# EAGLE design Li-Ion Batteryy (EAGLE 7.7.0)
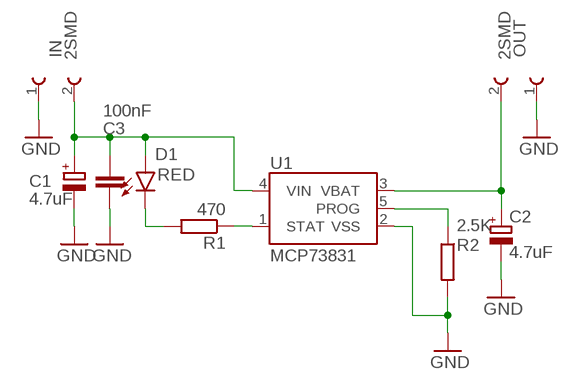
[diagram p0: schematic, sheet 1]

## Parts
C1  4.7uF  CPOL-EUSMCA  [SMC_A]
C2  4.7uF  CPOL-EUSMCA  [SMC_A]
C3  100nF  C-EUC0805  [C0805]
D1  RED  LED-RED1206  [LED-1206]
IN  2SMD  [2SMD]
OUT  2SMD  [2SMD]
R1  470  R-EU_R1206  [R1206]
R2  2.5K  R-EU_R1206  [R1206]
U1  MCP73831  [SOT23-5]

## Nets
GND: C1.- C2.- C3.2 IN.1 OUT.1 R2.2 U1.2(VSS)
N$1: R1.1 U1.1(STAT)
N$2: D1.C R1.2
N$4: R2.1 U1.5(PROG)
VBAT: C2.+ OUT.2 U1.3(VBAT)
VIN: C1.+ C3.1 D1.A IN.2 U1.4(VIN)

## Library data of the parts
C1 C2 = rcl:CPOL-EU: POLARIZED CAPACITOR, European symbol
C3 = rcl:C-EU: CAPACITOR, European symbol
D1 = SparkFun-LED:LED-RED: Assorted Red LEDs LilyPad 1206- DIO-09912 1206- DIO-00809 0603- DIO-00819; PROD_ID: DIO-00809
IN OUT = Wuerth_Elektronik_eiCan_Pin_&_Socked_Headers_v1.4:2SMD
R1 R2 = rcl:R-EU_: RESISTOR, European symbol
U1 = SparkFun-PowerIC:MCP73831: Miniature single cell, fully integrated Li-Ion, Li-polymer charge management controller http://ww1.microchip.com/downloads/en/DeviceDoc/21984a.pdf IC-09995; PROD_ID: IC-09995

## Board
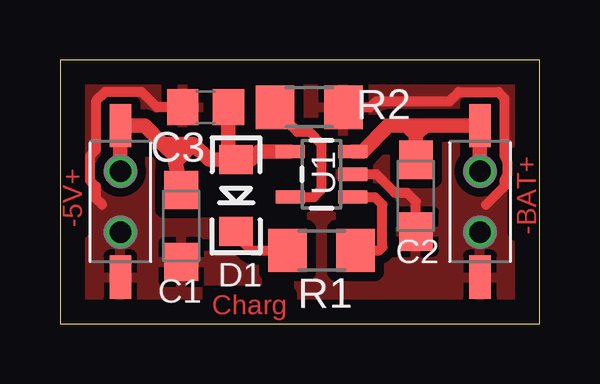
[diagram p1: board, top side]

Size 20 x 11 mm. Coordinates in mm from the lower left corner, seen from the top.
Outline: 0,0 20,0 20,11 0,11 0,0
Copper layers (1*16): Top 0.035mm / dielectric 1.5mm / Bottom 0.035mm
Design rules "default": minimum track width 10mil, minimum drill 24mil, track to track 8mil, track to pad 8mil, pad to pad 8mil, via to via 8mil, smd to smd 8mil, copper to edge 40mil, drill to drill 8mil, minimum pad ring 10mil, minimum via ring 8mil, stop-mask expansion 4mil, vias tented up to drill 0mil, thermal gap 10mil

### Footprints (pad centres in the part's own frame; a part is rotated, then mirrored left to right if it is on the bottom)
SMC_A = smd 1.6 x 1.4: + -1.5,0; - 1.5,0
C0805 = smd 1.3 x 1.5: 1 -0.95,0; 2 0.95,0
LED-1206 = smd 1.2 x 1.4: A -1.5,0; C 1.5,0
2SMD = smd 0.9 x 1.8: 1 0,3.15; 2 0,-3.17
R1206 = smd 1.6 x 1.803: 1 -1.422,0; 2 1.422,0
SOT23-5 = smd 0.55 x 1.2: 1 -0.95,-1.3; 2 0,-1.3; 3 0.95,-1.3; 4 0.95,1.3; 5 -0.95,1.3

### Placement (x,y rotation side)
C1  5.05,4.07 270 top
C2  14.83,5.34 270 top
C3  6.07,9.02 180 top
D1  7.34,5.34 270 top
IN  2.51,5.09 180 top
OUT  17.5,5.09 180 top
R1  10.89,3.05 180 top
R2  10.39,9.02 0 top
U1  10.89,6.23 90 top

### Tracks (layer width: path | path; a pad name or v marks a point on that pad's centre or on a via)
GND  (via drill 0.9)
  Top 0.406: C3.2 4.04,9.02 3.4,9.66 1.88,9.66 1.5,9.28 1.5,7.25 1.24,6.99 1.24,5.98 1.5,5.72 1.5,5.21 1.75,4.96 | R2.2 12.93,9.02 13.18,9.28 16.23,9.28 16.61,9.66 18.26,9.66 18.52,9.41 18.52,6.99 18.64,6.74 18.64,6.23 18.52,5.98 18.52,5.72 17.75,4.96 | U1.2 13.18,6.23 13.94,5.47 14.45,5.47 14.83,5.09 C2.-
  other vias: 2.51,3.82 17.5,3.82
  pour Top (isolate 0.381): -0.54,11.31 20.29,11.31 20.29,-0.12 -0.54,-0.12
N$1
  Top 0.406: U1.1 13.11,5.28 13.43,4.96 13.43,3.18 13.31,3.05 R1.1
N$2
  Top 0.406: D1.C 7.49,3.44 7.59,3.44 7.97,3.05 R1.2
N$4
  Top 0.406: U1.5 10.58,5.28 10.89,5.6 10.89,7.5 10.39,8.01 9.88,8.01 9.47,8.41 9.47,8.92 R2.1
VBAT  (via drill 0.9)
  Top 0.406: 14.83,7.75 14.83,7.88
  Top 0.61: 15.21,8.26 OUT.2 v17.5,6.36 | 15.21,8.26 13.68,8.26 12.61,7.18 U1.3 | C2.+ 14.83,7.75 | 14.83,7.88 15.21,8.26 | 14.83,7.88 14.45,8.26
VIN  (via drill 0.9)
  Top 0.61: D1.A 7.95,6.84 8.29,7.18 U1.4 | 4.29,7.5 3.53,8.26 IN.2 v2.51,6.36 | D1.A 6.22,6.84 5.56,7.5 | 5.56,7.5 4.29,7.5 | C1.+ 4.8,6.74 | 4.8,6.74 5.56,7.5 | D1.A 7.02,6.91 C3.1 | 4.8,6.74 4.8,6.99 4.29,7.5

### Text on the board
Top: -BAT+ | -5V+ | Charg